# EAGLE design spínač (EAGLE 9.6.2)
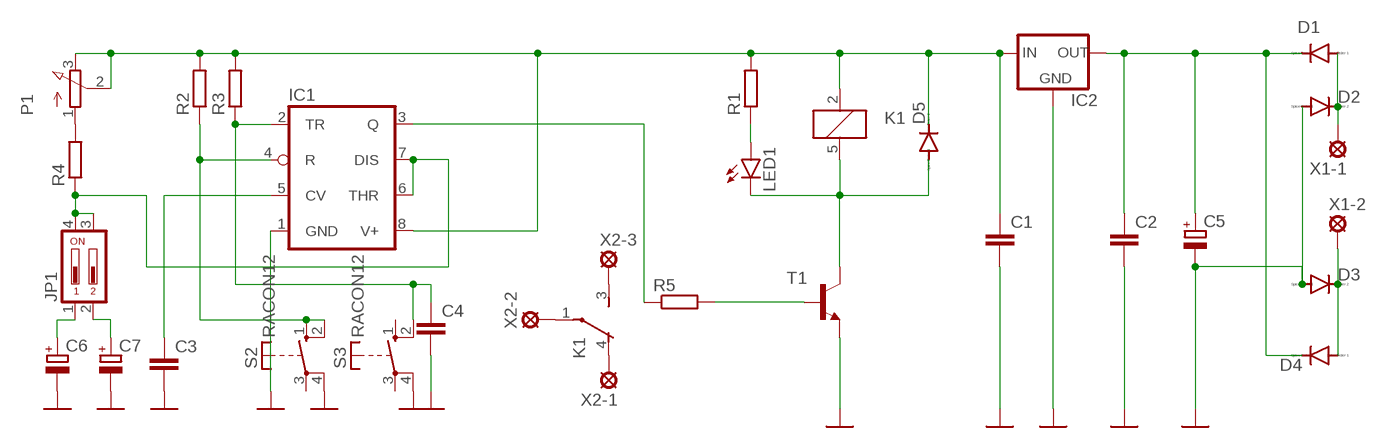
[diagram p0: schematic, sheet 1]

## Parts
C1  C-EU025-030X050  [C025-030X050]
C2  C-EU025-030X050  [C025-030X050]
C3  C-EU025-030X050  [C025-030X050]
C4  C-EU025-030X050  [C025-030X050]
C5  CPOL-EUB45181B  [B45181B]
C6  CPOL-EUB45181B  [B45181B]
C7  CPOL-EUB45181B  [B45181B]
D1  1N4004  [DO41-10]
D2  1N4004  [DO41-10]
D3  1N4004  [DO41-10]
D4  1N4004  [DO41-10]
D5  1N4004  [DO41-10]
IC1  LM555N  [DIL08]
IC2  78XXL  [78XXL]
JP1  219-02J  [CTS-219-02J]
K1  AZ8-FORM-C  [AZ8]
LED1  TLLR4400  [LED3MM]
P1  3RP/1610N  [3RP/1610N]
R1  R-EU_0207/10  [0207/10]
R2  R-EU_0207/10  [0207/10]
R3  R-EU_0207/10  [0207/10]
R4  R-EU_0207/10  [0207/10]
R5  R-EU_0207/10  [0207/10]
S2  RACON12  [RACON12]
S3  RACON12  [RACON12]
T1  2N3565  [TO92]
X1-1  SE14  [SE14]
X1-2  SE14  [SE14]
X2-1  SE14  [SE14]
X2-2  SE14  [SE14]
X2-3  SE14  [SE14]

## Nets
GND: C1.2 C2.2 C3.2 C4.2 C5.- C6.- C7.- D2.A D3.A IC1.1(GND) IC2.GND S2.4(P) S3.4(P) T1.3(E)
N$1: D3.C D4.A X1-2.MP
N$2: C2.1 C5.+ D1.C D4.C IC2.OUT
N$3: C1.1 D5.C IC1.8(V+) IC2.IN K1.2 P1.2(S) P1.3(E) R1.2 R2.2 R3.2
N$4: D1.A D2.C X1-1.MP
N$5: D5.A K1.5 LED1.K(C) T1.1(C)
N$6: LED1.A R1.1
N$7: R5.2 T1.2(B)
N$8: IC1.3(Q) R5.1
N$9: C4.1 IC1.2(TR) R3.1 S3.2(S)
N$10: IC1.4(R) R2.1 S2.1(S) S2.2(S)
N$11: C6.+ JP1.1
N$12: C7.+ JP1.2
N$13: IC1.6(THR) IC1.7(DIS) JP1.3 JP1.4 R4.1
N$14: P1.1(A) R4.2
N$15: C3.1 IC1.5(CV)
N$16: K1.3(-1:S) X2-3.MP
N$17: K1.1(-1:P) X2-2.MP
N$18: K1.4(-1:O) X2-1.MP
Unconnected: S2.3(P) S3.1(S) S3.3(P)

## Library data of the parts
C1-C4 = rcl:C-EU: CAPACITOR, European symbol; SPICEPREFIX: C
C5-C7 = rcl:CPOL-EU: POLARIZED CAPACITOR, European symbol; SPICEPREFIX: C
D1-D5 = diode:1N4004: DIODE general purpose rectifier, 1 A
IC1 = linear:*555: TIMER
IC2 = v-reg:78XXL: VOLTAGE REGULATOR
JP1 = switch-dil:219-02*: Surface Mount DIP Switch Series 219 SMT CTS Electronic Components Sourc: www.ctscorp.com; OC_FARNELL: unknown; OC_NEWARK: unknown
K1 = relay:AZ8-FORM-C: MINIATURE PC BOARD RELAY Form C Source: www.azettler.com .. AZ8-1ch-12DSE.PDF; OC_FARNELL: unknown; OC_NEWARK: unknown
LED1 = led:TLLR4400: Low Current (2mA) LED 3 mm Tinted Diffused Package color RED Source: Data sheet <http://www.farnell.com/datasheets/391100.pdf>; MF: VISHAY SEMICONDUCTOR; OC_FARNELL: 1612437
P1 = pot:3RP/1610N: 16mm Potentiometer one level Source: http://www.alphapotentiometers.net/html/16mm_pot_2.html
R1-R5 = rcl:R-EU_: RESISTOR, European symbol; SPICEPREFIX: R
S2 S3 = switch-misc:RACON12: ITT SWITCH
T1 = transistor:2N3565: NPN TRANSISTOR
X1-1 X1-2 X2-1-X2-3 = solpad:SE14: SOLDER PAD E1553, drill 1,4mm, distributor Buerklin, 07F820

## Board
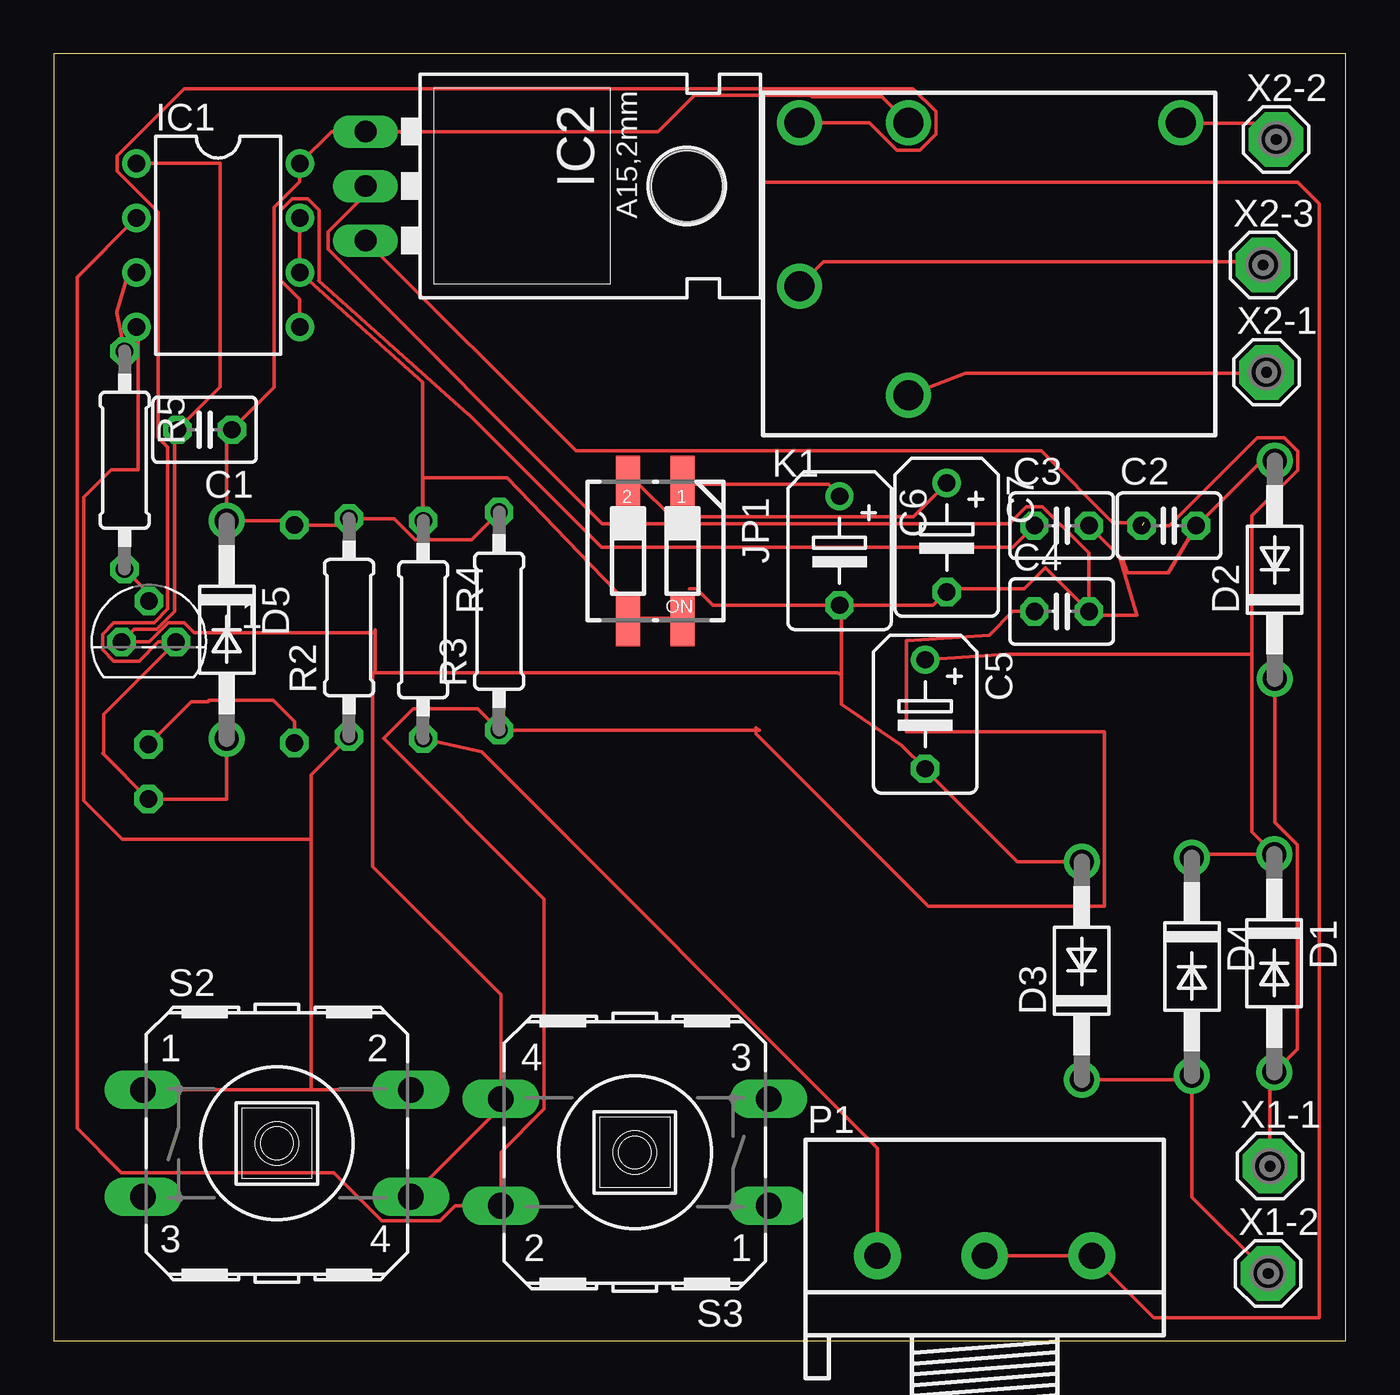
[diagram p1: board, top side]
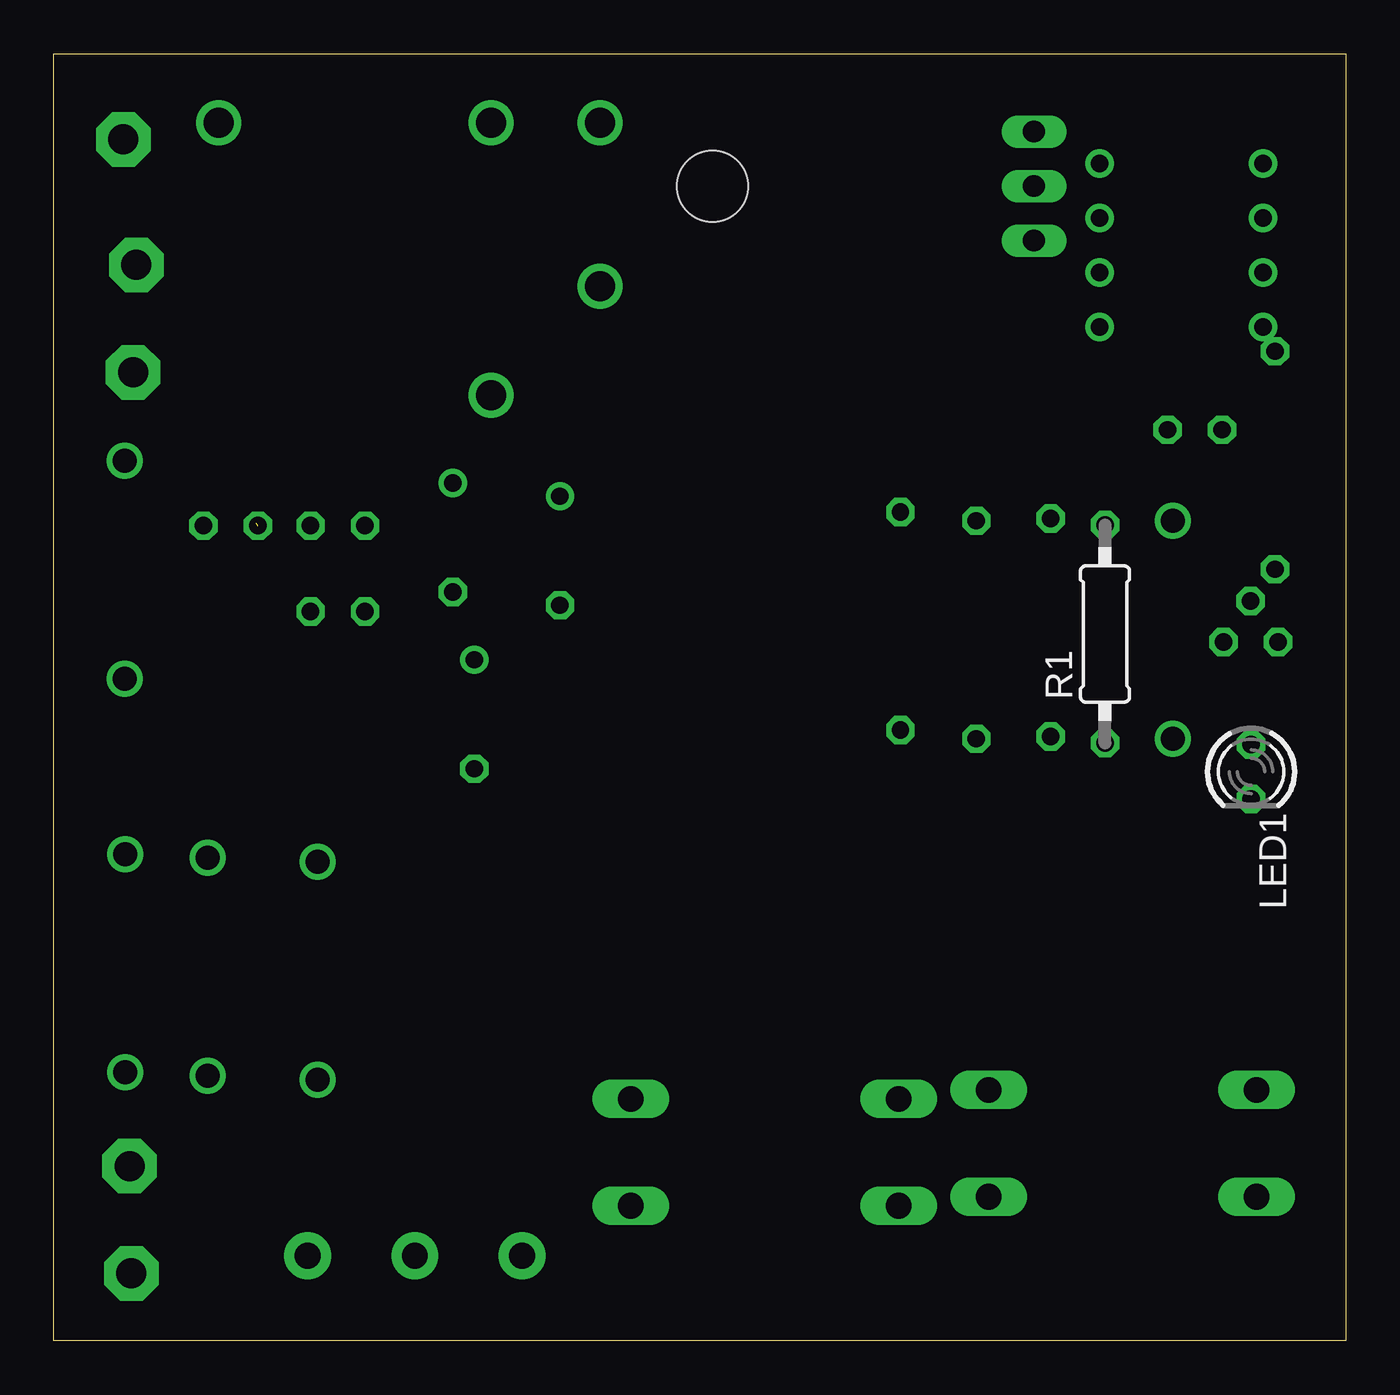
[diagram p2: board, bottom side, seen from below]

Size 60.25 x 60 mm. Coordinates in mm from the lower left corner, seen from the top.
Outline: 0,0 60.25,0 60.25,60 0,60 0,0
Copper layers (1*16): Top 0.035mm / dielectric 1.5mm / Bottom 0.035mm
Design rules "default": minimum track width 6mil, minimum drill 0.35mm, track to track 6mil, track to pad 6mil, pad to pad 6mil, via to via 6mil, smd to smd 6mil, copper to edge 40mil, drill to drill 6mil, minimum pad ring 10mil, minimum via ring 8mil, stop-mask expansion 4mil, vias tented up to drill 0mil, thermal gap 10mil

### Footprints (pad centres in the part's own frame; a part is rotated, then mirrored left to right if it is on the bottom)
C025-030X050 = drill 0.813 octagon: 1 -1.27,0; 2 1.27,0
B45181B = drill 0.813: + -2.54,0 | drill 0.813 octagon: - 2.54,0
DO41-10 = drill 1.118: A 5.08,0; C -5.08,0
DIL08 = drill 0.813 pad 1.27: 1 -3.81,-3.81; 2 -1.27,-3.81; 3 1.27,-3.81; 4 3.81,-3.81; 5 3.81,3.81; 6 1.27,3.81; 7 -1.27,3.81; 8 -3.81,3.81
78XXL = drill 1.016 long: GND 0,-3.81; IN -2.54,-3.81; OUT 2.54,-3.81 | hole 3.302: 0,11.176
CTS-219-02J = smd 1.13 x 2.44: 1 -1.27,-3.215; 2 1.27,-3.215; 3 1.27,3.215; 4 -1.27,3.215
AZ8 = drill 1.4 pad 2: 1 8.89,6.35; 2 -3.81,6.35; 3 -8.89,-1.27; 4 -3.81,-6.35; 5 -8.89,6.35
LED3MM = drill 0.813 octagon: A -1.27,0; K 1.27,0
3RP/1610N = drill 1.2 pad 2.184: 1 -5,0; 2 0,0; 3 5,0
0207/10 = drill 0.813 octagon: 1 -5.08,0; 2 5.08,0
RACON12 = drill 1.194 long: 1 -6.248,2.489; 2 6.248,2.489; 3 -6.248,-2.489; 4 6.248,-2.489
TO92 = drill 0.813 octagon: 1 1.27,0; 2 0,1.905; 3 -1.27,0
SE14 = drill 1.397 pad 2.54 octagon: MP 0,0

### Placement (x,y rotation side)
C1  7.04,42.47 180 top
C2  52,38 0 top
C3  47,38 0 top
C4  47,34 0 top
C5  40.64,29.21 270 top
C6  36.64,36.83 270 top
C7  41.64,37.45 270 top
D1  56.91,17.61 270 top
D2  56.93,35.95 90 top
D3  47.93,17.25 90 top
D4  53.07,17.45 270 top
D5  8.07,33.15 270 top
IC1  7.67,51.07 270 top
IC2  18.35,53.83 270 top
JP1  28.05,36.82 180 top
K1  43.66,50.43 0 top
LED1  4.42,26.53 270 bottom
P1  43.41,3.97 0 top
R1  11.23,32.95 90 bottom
R2  13.77,33.25 90 top
R3  20.77,33.55 90 top
R4  17.23,33.15 270 top
R5  3.31,41.05 270 top
S2  10.41,9.21 0 top
S3  27.1,8.79 180 top
T1  4.44,32.58 0 top
X1-1  56.71,8.15 0 top
X1-2  56.63,3.15 0 top
X2-1  56.55,45.15 0 top
X2-2  57,56 0 top
X2-3  56.39,50.15 0 top

### Tracks (layer width: path | path; a pad name or v marks a point on that pad's centre or on a via)
GND
  Top 0.152: D2.A 56.34,41.03 53.23,37.92 C2.2 51.97,35.81 50.07,35.81 49.85,36.42 C3.2 49.69,36.58 50.52,33.81 48.46,33.81 C4.2 | 36.73,31 36.73,29.68 39.53,27.78 C5.- 40.64,26.62 44.93,22.33 D3.A | 36.73,31 36.73,34.29 | C4.2 46.24,36.03 45.26,35.05 41.76,35.05 C7.- 41.6,34.9 41,34.29 36.73,34.29 | 36.73,34.29 C6.- | 36.58,34.29 C6.- | 4,54.88 IC1.1 7.77,54.88 7.77,44.47 C1.2 5.65,42.35 5.65,34.01 4.81,33.16 3.75,33.16 T1.3 4.45,32.58 5.34,33.47 6.08,33.47 6.55,33 15,33 | S2.4 20.85,10.91 S3.4 20.85,16.13 14.88,22.1 14.88,31.16 15,31.16 | 15,31.16 36.57,31.16 36.73,31 | 15,31.16 15,33 | 15,33 15,33.16 | C6.- 30.74,34.29 29.98,35.05 29.65,35.05 | IC2.GND 14.54,53.45 12.79,51.7 12.79,50.88 25.57,38.1 44.57,38.1 45.36,38.89 46.1,38.89 46.99,38 47,38 48.27,36.73 C4.2
N$1
  Top 0.152: X1-2.MP 53.07,6.71 D4.A 52.87,12.17 D3.C
N$2  (1 unrouted)
  Top 0.152: D4.C 53.23,22.69 D1.C 55.86,23.74 55.86,32 | C5.+ 44.39,32 55.86,32 | IC2.OUT 24.35,41.48 46.04,41.48 49.4,38.13 50.83,38.13 | C2.1 52.01,38 56.11,42.1 57.37,42.1 58,41.47 58,40.59 55.86,38.45 55.86,32
N$3
  Top 0.152: P1.2 P1.3 51.29,1.09 59,1.09 59,53 58,54 33,54 33,58.06 | R3.2 19.48,37.34 16.86,37.34 15.87,38.33 R2.2 13.47,38.03 R1.2 11.03,38.23 D5.C 8.07,42.23 C1.1 10.29,44.45 10.29,52.83 11.48,54.03 IC1.8 12.97,56.37 IC2.IN 28.19,56.37 29.88,58.06 33,58.06 | 33,58.06 35.3,58.06 35.36,58 38.63,58 K1.2
N$4
  Top 0.152: 56.93,8.37 X1-1.MP 56.71,12.33 D1.A 57.98,13.6 57.98,23.13 56.93,24.18 D2.C
N$5
  Top 0.152: D5.A 8.07,25.26 LED1.K 2.34,27.34 | 2.34,27.34 2.29,27.39 | 2.34,27.34 2.34,29.21 T1.1 4.88,32.58 4,31.69 2.8,31.69 2.28,32.21 2.28,32.95 2.8,33.47 4.68,33.47 5.33,34.12 5.33,41.65 4.88,42.1 4.88,52.6 2.97,54.51 2.97,55.25 6.09,58.36 40.08,58.36 41.13,57.31 41.13,56.25 40.38,55.5 39.32,55.5 38.04,56.78 K1.5
  Bottom 0.152: 34.9,56.76 K1.5 34.75,56.76
N$6
  Top 0.152: R1.1 11.23,28.87 10.23,29.87 7.23,29.87 7.21,29.8 6.42,29.8 LED1.A
N$7
  Top 0.152: T1.2 4.44,34.84 R5.2
N$8
  Top 0.152: IC1.3 3.84,49.84 3.5,49.84 2.94,47.94 R5.1
N$9
  Top 0.152: IC1.2 1.09,49.57 1.09,9.91 3.15,7.84 13.05,7.84 15.3,5.6 18.02,5.6 18.72,6.3 S3.2 20.85,8.79 22.87,10.81 22.87,20.6 15.38,28.09 16.77,29.47 19.77,29.47 R3.1 32.92,28.47 32.75,28.58 32.75,28.3 40.79,20.26 49,20.26 49,28.4 39.75,28.4 39.75,32.64 43.63,32.9 44.73,34 C4.1
N$10
  Top 0.152: S2.1 S2.2 12,11.7 12,23.39 | IC1.4 3.86,47.3 3.94,47.23 3.94,40.6 2.68,40.6 1.4,39.32 1.4,25.18 3.2,23.39 12,23.39 | R2.1 12,26.4 12,23.39
  Bottom 0.152: 16.61,11.73 S2.2 | 13.73,28.19 R2.1
N$11
  Top 0.152: JP1.1 29.41,39.93 36.12,39.93 36.58,39.47 C6.+
N$12
  Top 0.152: JP1.2 26.82,39.93 27.28,39.93 28.8,38.41 40.08,38.41 41.6,39.93 C7.+
N$13
  Top 0.152: JP1.4 29.26,33.68 26.82,33.68 JP1.3 26.78,34.37 21.15,40.23 17.23,40.23 R4.1 17.2,38.26 17.2,44.69 IC1.6 IC1.7
N$14
  Top 0.152: R4.2 19.94,27.45 38.41,8.99 38.41,4.12 P1.1
N$15
  Top 0.152: IC1.5 11.48,48.54 10.59,49.43 10.59,52.71 11.11,53.23 11.85,53.23 12.37,52.71 12.37,49.43 12.36,49.42 19.32,43.2 19.34,43.2 25.54,37 44.73,37 C3.1
N$16
  Top 0.152: K1.3 35.88,50.29 56.52,50.29 X2-3.MP
N$17
  Top 0.152: K1.1 52.57,56.76 56.99,56.76 X2-2.MP
N$18
  Top 0.152: K1.4 42.52,45.11 56.45,45.11 X2-1.MP